# Altium project D02.PrjPcb (part 2 of 2)

## Sheet D02-2-00 Logic Level Translators.SchDoc
size A3; SheetNumber: 3; SheetTotal: 3
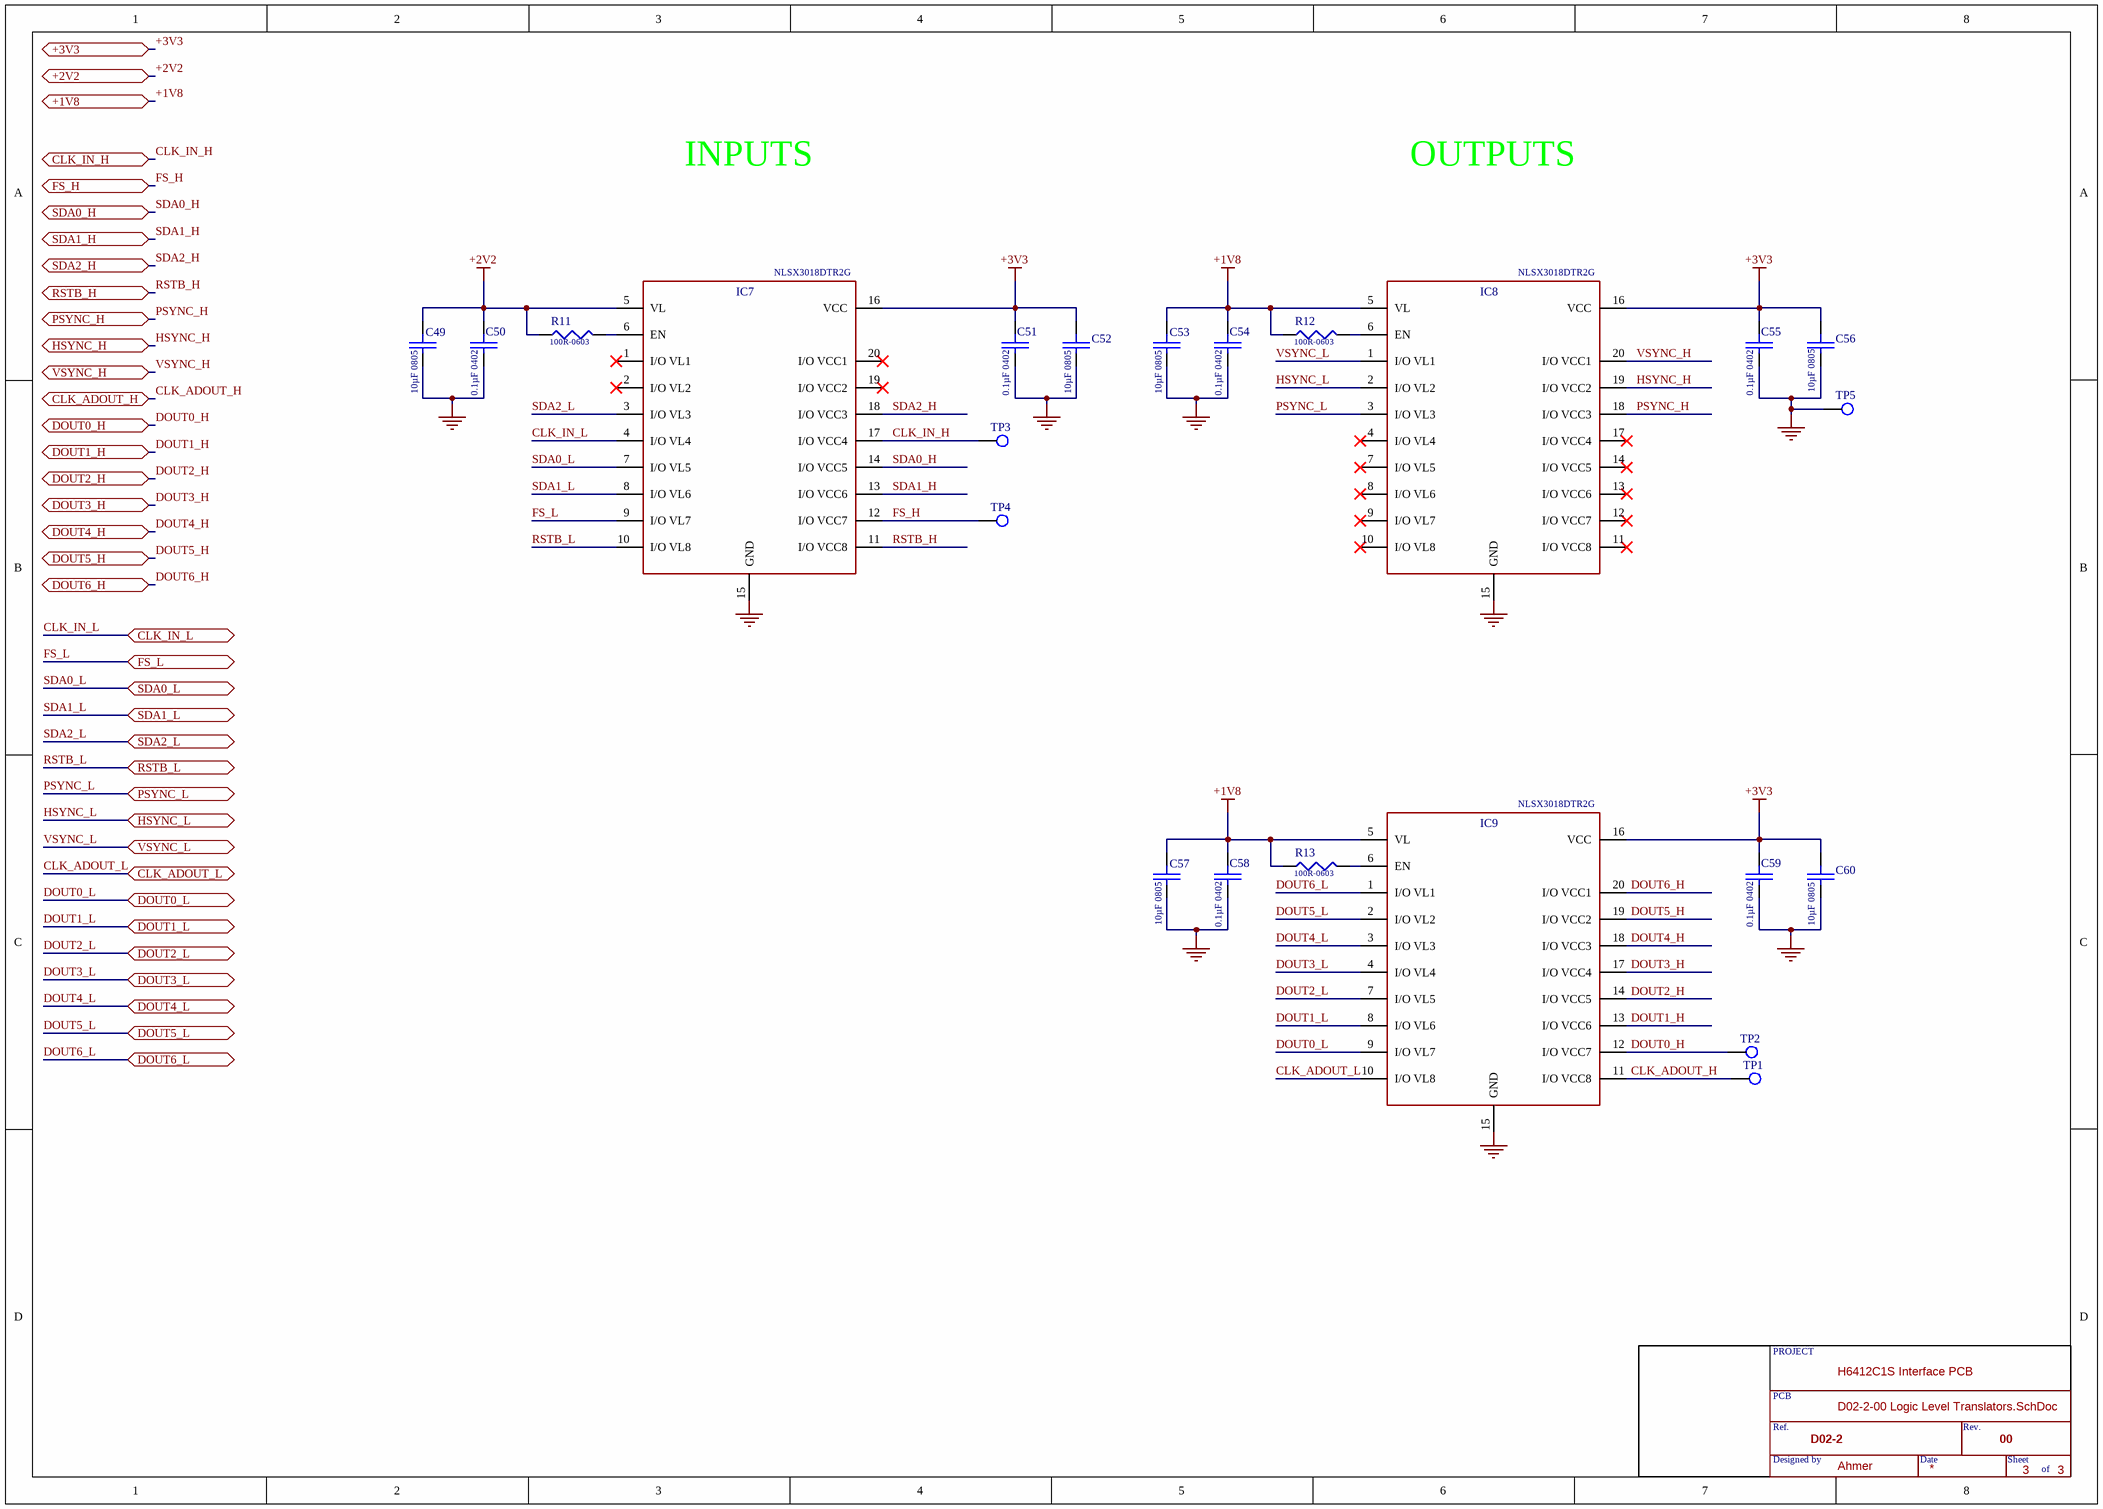
[diagram p2: D02-2-00 Logic Level Translators.SchDoc]

### Parts
(Parts that share a designator on the sheet are numbered #1, #2 ... from top to bottom, then left to right.)
*?#3  Title Box  (value not drawn)
C49  10µF 0805  [C-0805]
C50  0.1µF 0402  [C-0402]
C51  0.1µF 0402  [C-0402]
C52  10µF 0805  [C-0805]
C53  10µF 0805  [C-0805]
C54  0.1µF 0402  [C-0402]
C55  0.1µF 0402  [C-0402]
C56  10µF 0805  [C-0805]
C57  10µF 0805  [C-0805]
C58  0.1µF 0402  [C-0402]
C59  0.1µF 0402  [C-0402]
C60  10µF 0805  [C-0805]
IC7  NLSX3018DTR2G  [TSSOP-20 for NLSX3018]
IC8  NLSX3018DTR2G  [TSSOP-20 for NLSX3018]
IC9  NLSX3018DTR2G  [TSSOP-20 for NLSX3018]
R11  100R-0603  [R0603]
R12  100R-0603  [R0603]
R13  100R-0603  [R0603]
TP1  Test Point 1.5mm  [Test Point 1.5mm]  (value not drawn)
TP2  Test Point 1.5mm  [Test Point 1.5mm]  (value not drawn)
TP3  Test Point 1.5mm  [Test Point 1.5mm]  (value not drawn)
TP4  Test Point 1.5mm  [Test Point 1.5mm]  (value not drawn)
TP5  Test Point 1.5mm  [Test Point 1.5mm]  (value not drawn)

### Ports
+1V8 (bidir), +2V2 (bidir), +3V3 (bidir), CLK_ADOUT_H (bidir), CLK_ADOUT_L (bidir), CLK_IN_H (bidir), CLK_IN_L (bidir), DOUT0_H (bidir), DOUT0_L (bidir), DOUT1_H (bidir), DOUT1_L (bidir), DOUT2_H (bidir), DOUT2_L (bidir), DOUT3_H (bidir), DOUT3_L (bidir), DOUT4_H (bidir), DOUT4_L (bidir), DOUT5_H (bidir), DOUT5_L (bidir), DOUT6_H (bidir), DOUT6_L (bidir), FS_H (bidir), FS_L (bidir), HSYNC_H (bidir), HSYNC_L (bidir), PSYNC_H (bidir), PSYNC_L (bidir), RSTB_H (bidir), RSTB_L (bidir), SDA0_H (bidir), SDA0_L (bidir), SDA1_H (bidir), SDA1_L (bidir), SDA2_H (bidir), SDA2_L (bidir), VSYNC_H (bidir), VSYNC_L (bidir)

### Nets
+1V8: C53.2 C54.2 C57.2 C58.2 IC8.5(VL) IC9.5(VL) R12.1 R13.1 ; port +1V8
+2V2: C49.2 C50.2 IC7.5(VL) R11.1 ; port +2V2
+3V3: C51.2 C52.2 C55.2 C56.2 C59.2 C60.2 IC7.16(VCC) IC8.16(VCC) IC9.16(VCC) ; port +3V3
GND: C49.1 C50.1 C51.1 C52.1 C53.1 C54.1 C55.1 C56.1 C57.1 C58.1 C59.1 C60.1 IC7.15(GND) IC8.15(GND) IC9.15(GND) TP5.1  [project net GNDA]
CLK_ADOUT_H: IC9.11(I/O_VCC8) TP1.1 ; port CLK_ADOUT_H
CLK_ADOUT_L: IC9.10(I/O_VL8) ; port CLK_ADOUT_L
CLK_IN_H: IC7.17(I/O_VCC4) TP3.1 ; port CLK_IN_H
CLK_IN_L: IC7.4(I/O_VL4) ; port CLK_IN_L
DOUT0_H: IC9.12(I/O_VCC7) TP2.1 ; port DOUT0_H
DOUT0_L: IC9.9(I/O_VL7) ; port DOUT0_L
DOUT1_H: IC9.13(I/O_VCC6) ; port DOUT1_H
DOUT1_L: IC9.8(I/O_VL6) ; port DOUT1_L
DOUT2_H: IC9.14(I/O_VCC5) ; port DOUT2_H
DOUT2_L: IC9.7(I/O_VL5) ; port DOUT2_L
DOUT3_H: IC9.17(I/O_VCC4) ; port DOUT3_H
DOUT3_L: IC9.4(I/O_VL4) ; port DOUT3_L
DOUT4_H: IC9.18(I/O_VCC3) ; port DOUT4_H
DOUT4_L: IC9.3(I/O_VL3) ; port DOUT4_L
DOUT5_H: IC9.19(I/O_VCC2) ; port DOUT5_H
DOUT5_L: IC9.2(I/O_VL2) ; port DOUT5_L
DOUT6_H: IC9.20(I/O_VCC1) ; port DOUT6_H
DOUT6_L: IC9.1(I/O_VL1) ; port DOUT6_L
FS_H: IC7.12(I/O_VCC7) TP4.1 ; port FS_H
FS_L: IC7.9(I/O_VL7) ; port FS_L
HSYNC_H: IC8.19(I/O_VCC2) ; port HSYNC_H
HSYNC_L: IC8.2(I/O_VL2) ; port HSYNC_L
PSYNC_H: IC8.18(I/O_VCC3) ; port PSYNC_H
PSYNC_L: IC8.3(I/O_VL3) ; port PSYNC_L
RSTB_H: IC7.11(I/O_VCC8) ; port RSTB_H
RSTB_L: IC7.10(I/O_VL8) ; port RSTB_L
SDA0_H: IC7.14(I/O_VCC5) ; port SDA0_H
SDA0_L: IC7.7(I/O_VL5) ; port SDA0_L
SDA1_H: IC7.13(I/O_VCC6) ; port SDA1_H
SDA1_L: IC7.8(I/O_VL6) ; port SDA1_L
SDA2_H: IC7.18(I/O_VCC3) ; port SDA2_H
SDA2_L: IC7.3(I/O_VL3) ; port SDA2_L
VSYNC_H: IC8.20(I/O_VCC1) ; port VSYNC_H
VSYNC_L: IC8.1(I/O_VL1) ; port VSYNC_L
NetIC7_6: IC7.6(EN) R11.2
NetIC8_6: IC8.6(EN) R12.2
NetIC9_6: IC9.6(EN) R13.2

Not connected (* = marked no-connect by the designer): IC7 1(I/O_VL1)* 2(I/O_VL2)* 19(I/O_VCC2)* 20(I/O_VCC1)*; IC8 4(I/O_VL4)* 7(I/O_VL5)* 8(I/O_VL6)* 9(I/O_VL7)* 10(I/O_VL8)* 11(I/O_VCC8)* 12(I/O_VCC7)* 13(I/O_VCC6)* 14(I/O_VCC5)* 17(I/O_VCC4)*

### Notes on the sheet
- INPUTS
- OUTPUTS
- (in symbol Title Box) PROJECT; H6412C1S Interface PCB; PCB; Ref.; Rev.; D02-2; 00; Designed by; Date; Sheet; Ahmer; of

### Library data of the parts
C49 C52 C53 C56 C57 C60 = CL21B106KOQNNNG: CC 10µF 0805 16V 10% X7R; Manufacturer: Samsung; Material: Ceramic; Capacitance: 10uF; Supplier 1: Digi-Key; Supplier Part Number 1: 1276-6472-1-ND; Manufacturer Part Number: CL21B106KOQNNNG; RoHS: Yes; Category: Ceramic Capacitors; Stock: 446707; Pricing: 1=0.30000, 10=0.20200, 50=0.12120, 100=0.10230, 500=0.07002, 1000=0.06195 (USD); Mount: Surface Mount; Case/Package: 0805; Case Code (Metric): 2012; Case Code (Imperial): 0805; Min Operating Temperature: -55°C; Max Operating Temperature: 125°C; Tolerance: 10%; Packaging: Tape and Reel; Package Quantity: 3000; Voltage Rating: 16V; Dielectric: X7R; Series: CL; Length: 0.079inch; Width: 0.049inch; Thickness: 0.055inch; Depth: 1.25mm; Lead Free: Lead Free; RoHS Compliant: Yes; ComponentLink1URL: https://datasheet.ciiva.com/25728/cl21b106koqnnng-25728106.pdf?src-supplier=Digi-Key; ComponentLink1Description: https://datasheet.ciiva.com/25728/cl21b106koqnnng-25728106.pdf?src-supplier=Digi-Key; ComponentLink2URL: https://datasheet.ciiva.com/29199/454918-da-01-en-vs-kondensator-0805-29199421.pdf?src-supplier=Conrad; ComponentLink2Description: https://datasheet.ciiva.com/29199/454918-da-01-en-vs-kondensator-0805-29199421.pdf?src-supplier=Conrad
C50 C51 C54 C55 C58 C59 = GCM155R71C104KA55D: CC 0.1µF 0402 16V ±10% X7R; Manufacturer: Murata; Capacitance: 100nF; Supplier 1: Digi-Key; Manufacturer Part Number: GCM155R71C104KA55D; RoHS: Yes; Category: Ceramic Capacitors; Stock 1: 7256827; Pricing 1: 1=0.10000, 10=0.03500, 50=0.01920, 100=0.01560, 500=0.01116, 1000=0.00877, 2500=0.00798, 5000=0.00734 (USD); Mount: Surface Mount; Case/Package: 0402; Case Code (Metric): 1005; Case Code (Imperial): 0402; Min Operating Temperature: -55°C; Max Operating Temperature: 125°C; Tolerance: 10%; Dielectric: X7R; Package Quantity: 1; Packaging: Tape and Reel; Voltage Rating: 16V; Voltage Rating (DC): 16V; Termination: SMD/SMT; Voltage: 16V; Series: GCM; Construction: Flat; Length: 1mm; Width: 0.02inch; Height: 0.5mm; Thickness: 0.022inch; Depth: 0.5mm; Ratings: AEC-Q200; Radiation Hardening: No; REACH SVHC: No SVHC; Lead Free: Lead Free; RoHS Compliant: Yes; ComponentLink1URL: https://datasheet.ciiva.com/11786/0900766b80ef92d0-11786380.pdf?src-supplier=RSComponents; ComponentLink1Description: https://datasheet.ciiva.com/11786/0900766b80ef92d0-11786380.pdf?src-supplier=RSComponents; ComponentLink2URL: https://datasheet.ciiva.com/18183/getdatasheetpartid-220774-18183517.pdf?src-supplier=Verical; ComponentLink2Description: https://datasheet.ciiva.com/18183/getdatasheetpartid-220774-18183517.pdf?src-supplier=Verical; ComponentLink3URL: https://datasheet.ciiva.com/2989/product-2989234.pdf?src-supplier=Avnet; ComponentLink3Description: https://datasheet.ciiva.com/2989/product-2989234.pdf?src-supplier=Avnet; ComponentLink4URL: https://datasheet.ciiva.com/164/product-164315.pdf?src-supplier=Digi-Key; ComponentLink4Description: https://datasheet.ciiva.com/164/product-164315.pdf?src-supplier=Digi-Key; ComponentLink5URL: https://datasheet.ciiva.com/164/product-164316.pdf?src-supplier=Digi-Key; ComponentLink5Description: https://datasheet.ciiva.com/164/product-164316.pdf?src-supplier=Digi-Key; ComponentLink6URL: https://datasheet.ciiva.com/11463/product-11463804.pdf?src-supplier=Avnet; ComponentLink6Description: https://datasheet.ciiva.com/11463/product-11463804.pdf?src-supplier=Avnet; Supplier Part Number 1: 490-4759-1-ND
IC7-IC9 = NLSX3018DTR2G: IC VOLTAGE LEVEL TRANSLATOR8-CH BIDIRECTIONAL 20-PIN TSSOP W T/R; Manufacturer: ON Semiconductor; Data Rate: 110Mbps; Number of Channels: 8; Propagation Delay: 6.5ns; Max Supply Voltage: 5.5V; Min Supply Voltage: -500mV; Turn-On Delay Time: 160ns; Low Level Output Current: 20uA; High Level Output Current: -20uA; Supplier 1: Digi-Key; Supplier Part Number 1: NLSX3018DTR2GOSCT-ND; Manufacturer Part Number: NLSX3018DTR2G; RoHS: Yes; Category: Voltage Level Shifters; Stock: 99; Pricing: 1=2.04000, 10=1.82900, 25=1.72520, 100=1.46980, 250=1.38012, 500=1.20760, 1000=1.13925 (USD); Mount: Surface Mount; Case/Package: TSSOP; Number of Pins: 20; Min Operating Temperature: -40°C; Max Operating Temperature: 85°C; Packaging: Tape and Reel; Package Quantity: 2500; Logic Function: Translator; Number of Bits: 8; Output Type: Voltage; Series: -; Lead Free: Lead Free; Halogen Free: Halogen Free; RoHS Compliant: Yes; ComponentLink1URL: https://datasheet.ciiva.com/8246/nlsx3018-d-8246180.pdf?src-supplier=Avnet; ComponentLink1Description: https://datasheet.ciiva.com/8246/nlsx3018-d-8246180.pdf?src-supplier=Avnet; ComponentLink2URL: https://datasheet.ciiva.com/1900/nlsx3018-d-1900882.pdf?src-supplier=Digi-Key; ComponentLink2Description: https://datasheet.ciiva.com/1900/nlsx3018-d-1900882.pdf?src-supplier=Digi-Key
R11-R13 = RMCF0603FT100R: Res 100 Ohm 0603 1% 0.1W(1/10W) ±100ppm/C Pad SMD Automotive T/R; Manufacturer: Stackpole Electronics; Resistance (Ohms): 100; Power (Watts): 0.1W, 1/10W; Temperature Coefficient: ±100ppm/°C; Supplier 1: Digi-Key; Manufacturer Part Number: RMCF0603FT100R; Stock 1: 1208013; Pricing 1: 1=0.1, 10=0.016, 100=0.0065, 1000=0.0029, 2500=0.0025 (USD); Category: Resistors; Family: Chip Resistor - Surface Mount; Series: RMCF; Packaging: Cut Tape (CT); Tolerance: ±1%; Composition: Thick Film; Features: Automotive AEC-Q200; Operating Temperature: -55°C ~ 155°C; Package / Case: 0603 (1608 Metric); Supplier Device Package: 0603; Size / Dimension: 0.061" L x 0.031" W (1.55mm x 0.80mm); Height: 0.022" (0.55mm); Number of Terminations: 2; ComponentLink1URL: https://www.verical.com/server-webapp/html/getDatasheet?partID=360413&src-supplier=Verical; ComponentLink1Description: https://www.verical.com/server-webapp/html/getDatasheet?partID=360413&src-supplier=Verical; Supplier Part Number 1: RMCF0603FT100RCT-ND

## Nets that join several sheets
+1V8: D02-2-00 Circuit Power (C47.2 C48.2 IC6.5), D02-2-00 Logic Level Translators (8 pins)
+2V2: D02-2-00 Circuit Top Sheet (L5.1), D02-2-00 Circuit Power (C31.2 C32.2 IC2.5), D02-2-00 Logic Level Translators (C49.2 C50.2 IC7.5 R11.1)
+3V3: D02-2-00 Circuit Power (C44.2 C45.2 IC5.5), D02-2-00 Logic Level Translators (9 pins)
+3V6: D02-2-00 Circuit Top Sheet (L3.1 L4.1), D02-2-00 Circuit Power (6 pins)
+6V8: D02-2-00 Circuit Top Sheet (L6.1), D02-2-00 Circuit Power (5 pins)
+VA8: D02-2-00 Circuit Top Sheet (C2.2 C87.2 L1.2 L13.2), D02-2-00 Circuit Power (L9.1 L10.2)
+VD4: D02-2-00 Circuit Top Sheet (C4.2 C89.2 L2.2 L14.2), D02-2-00 Circuit Power (L7.1 L8.1 L11.1 L12.1)
GNDA: D02-2-00 Circuit Top Sheet (54 pins), D02-2-00 Circuit Power (40 pins), D02-2-00 Logic Level Translators (16 pins)
CLK_ADOUT_H: D02-2-00 Circuit Top Sheet (P3.11 P4.11), D02-2-00 Logic Level Translators (IC9.11 TP1.1)
CLK_ADOUT_L: D02-2-00 Circuit Top Sheet (P2.22), D02-2-00 Logic Level Translators (IC9.10)
CLK_IN_H: D02-2-00 Circuit Top Sheet (P3.18 P4.18), D02-2-00 Logic Level Translators (IC7.17 TP3.1)
CLK_IN_L: D02-2-00 Circuit Top Sheet (R10.2), D02-2-00 Logic Level Translators (IC7.4)
DOUT0_H: D02-2-00 Circuit Top Sheet (P3.27 P4.27), D02-2-00 Logic Level Translators (IC9.12 TP2.1)
DOUT0_L: D02-2-00 Circuit Top Sheet (P2.30), D02-2-00 Logic Level Translators (IC9.9)
DOUT1_H: D02-2-00 Circuit Top Sheet (P3.26 P4.26), D02-2-00 Logic Level Translators (IC9.13)
DOUT1_L: D02-2-00 Circuit Top Sheet (P2.29), D02-2-00 Logic Level Translators (IC9.8)
DOUT2_H: D02-2-00 Circuit Top Sheet (P3.25 P4.25), D02-2-00 Logic Level Translators (IC9.14)
DOUT2_L: D02-2-00 Circuit Top Sheet (P2.26), D02-2-00 Logic Level Translators (IC9.7)
DOUT3_H: D02-2-00 Circuit Top Sheet (P3.24 P4.24), D02-2-00 Logic Level Translators (IC9.17)
DOUT3_L: D02-2-00 Circuit Top Sheet (P2.25), D02-2-00 Logic Level Translators (IC9.4)
DOUT4_H: D02-2-00 Circuit Top Sheet (P3.22 P4.22), D02-2-00 Logic Level Translators (IC9.18)
DOUT4_L: D02-2-00 Circuit Top Sheet (P2.14), D02-2-00 Logic Level Translators (IC9.3)
DOUT5_H: D02-2-00 Circuit Top Sheet (P3.21 P4.21), D02-2-00 Logic Level Translators (IC9.19)
DOUT5_L: D02-2-00 Circuit Top Sheet (P2.13), D02-2-00 Logic Level Translators (IC9.2)
DOUT6_H: D02-2-00 Circuit Top Sheet (P3.20 P4.20), D02-2-00 Logic Level Translators (IC9.20)
DOUT6_L: D02-2-00 Circuit Top Sheet (P2.10), D02-2-00 Logic Level Translators (IC9.1)
FS_H: D02-2-00 Circuit Top Sheet (P3.14 P4.14), D02-2-00 Logic Level Translators (IC7.12 TP4.1)
FS_L: D02-2-00 Circuit Top Sheet (P2.2), D02-2-00 Logic Level Translators (IC7.9)
HSYNC_H: D02-2-00 Circuit Top Sheet (P3.35 P4.35), D02-2-00 Logic Level Translators (IC8.19)
HSYNC_L: D02-2-00 Circuit Top Sheet (P1.25), D02-2-00 Logic Level Translators (IC8.2)
PSYNC_H: D02-2-00 Circuit Top Sheet (P3.36 P4.36), D02-2-00 Logic Level Translators (IC8.18)
PSYNC_L: D02-2-00 Circuit Top Sheet (P1.22), D02-2-00 Logic Level Translators (IC8.3)
RSTB_H: D02-2-00 Circuit Top Sheet (P3.2 P4.2), D02-2-00 Logic Level Translators (IC7.11)
RSTB_L: D02-2-00 Circuit Top Sheet (P2.9), D02-2-00 Logic Level Translators (IC7.10)
SDA0_H: D02-2-00 Circuit Top Sheet (P3.16 P4.16), D02-2-00 Logic Level Translators (IC7.14)
SDA0_L: D02-2-00 Circuit Top Sheet (P1.29), D02-2-00 Logic Level Translators (IC7.7)
SDA1_H: D02-2-00 Circuit Top Sheet (P3.15 P4.15), D02-2-00 Logic Level Translators (IC7.13)
SDA1_L: D02-2-00 Circuit Top Sheet (P1.30), D02-2-00 Logic Level Translators (IC7.8)
SDA2_H: D02-2-00 Circuit Top Sheet (P3.38 P4.38), D02-2-00 Logic Level Translators (IC7.18)
SDA2_L: D02-2-00 Circuit Top Sheet (P2.1), D02-2-00 Logic Level Translators (IC7.3)
VSYNC_H: D02-2-00 Circuit Top Sheet (P3.34 P4.34), D02-2-00 Logic Level Translators (IC8.20)
VSYNC_L: D02-2-00 Circuit Top Sheet (P1.26), D02-2-00 Logic Level Translators (IC8.1)